# EAGLE schematic testSchema (EAGLE 7.2.0)
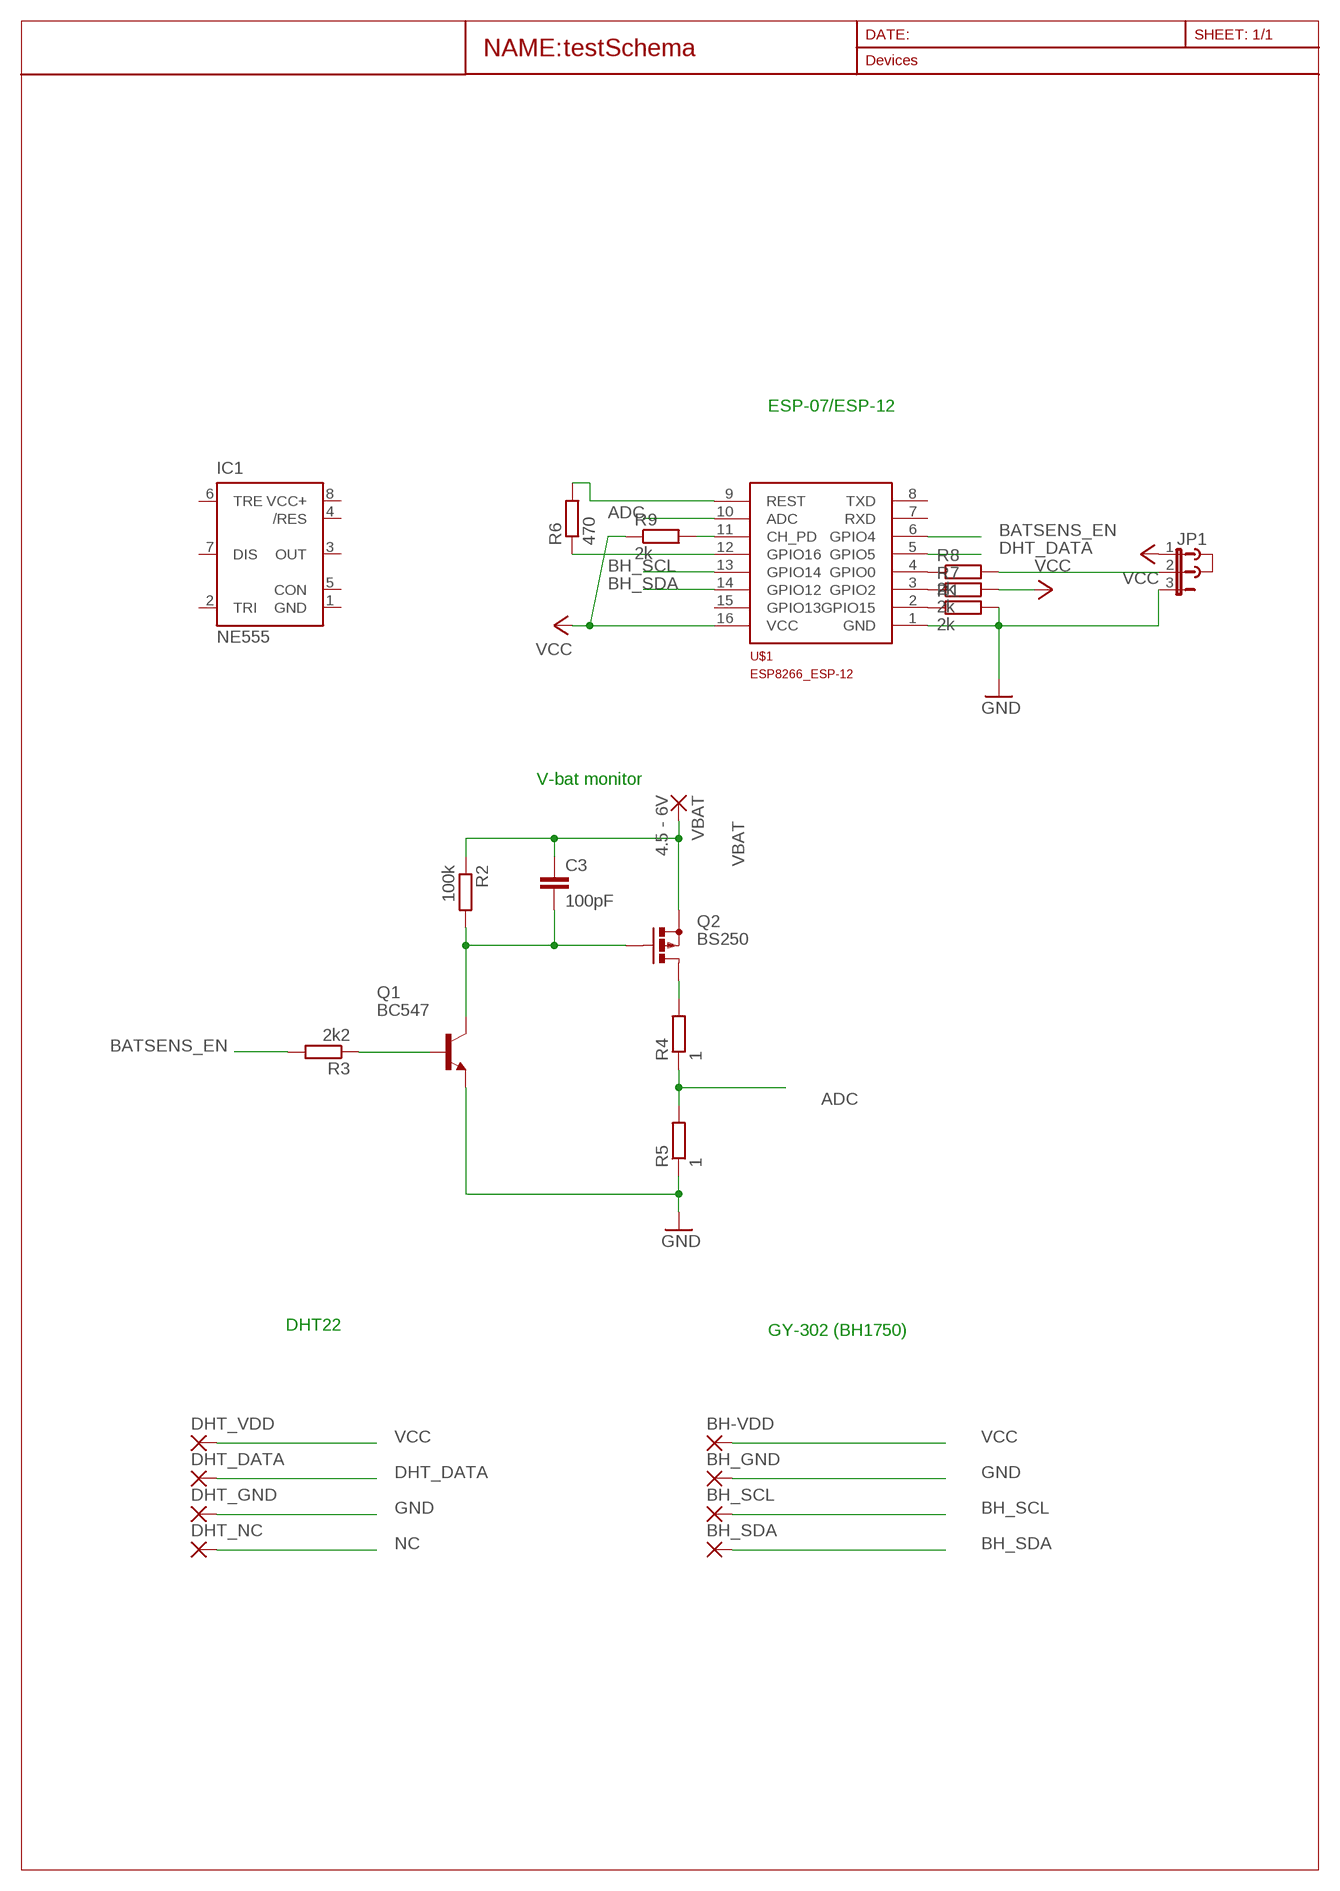
[diagram p0: schematic, sheet 1]

## Parts
BH-VDD  2,54/1,0  [2,54/1,0]
BH_GND  2,54/1,0  [2,54/1,0]
BH_SCL  2,54/1,0  [2,54/1,0]
BH_SDA  2,54/1,0  [2,54/1,0]
C3  100pF  C-EU025-025X050  [C025-025X050]
DHT_DATA  2,54/1,0  [2,54/1,0]
DHT_GND  2,54/1,0  [2,54/1,0]
DHT_NC  2,54/1,0  [2,54/1,0]
DHT_VDD  2,54/1,0  [2,54/1,0]
IC1  NE555  [DIL-08]
J1  JUMPER  [JUMP]
JP1  JP2E  [JP2]
Q1  BC547  [TO92]
Q2  BS250  [SOT54E]
R1  2k  R-EU_0204/7  [0204/7]
R2  100k  R-EU_0204/7  [0204/7]
R3  2k2  R-EU_0204/7  [0204/7]
R4  1  R-EU_0204/7  [0204/7]
R5  1  R-EU_0204/7  [0204/7]
R6  470  R-EU_0204/7  [0204/7]
R7  2k  R-EU_0204/7  [0204/7]
R8  2k  R-EU_0204/7  [0204/7]
R9  2k  R-EU_0204/7  [0204/7]
U$1  ESP8266_ESP-12  [ESP8266-ESP12]
VBAT  4.5 - 6V  2,54/1,0  [2,54/1,0]

## Nets
ADC: R4.1 R5.2 U$1.10(ADC)
BATSENS_EN: R3.2 U$1.6(GPIO4)
BH_SCL: BH_SCL.1(P) U$1.13(GPIO14)
BH_SDA: BH_SDA.1(P) U$1.14(GPIO12)
DHT_DATA: DHT_DATA.1(P) U$1.5(GPIO5)
GND: BH_GND.1(P) DHT_GND.1(P) JP1.3 Q1.1(E) R1.2 R5.1 U$1.1(GND)
N$1: R6.1 U$1.12(GPIO16)
N$2: Q2.D R4.2
N$3: R1.1 U$1.2(GPIO15)
N$4: Q1.2(B) R3.1
N$5: C3.2 Q1.3(C) Q2.G R2.2
N$6: R7.1 U$1.3(GPIO2)
N$7: JP1.2 R8.2
N$8: R8.1 U$1.4(GPIO0)
N$9: R9.2 U$1.11(CH_PD)
NC: DHT_NC.1(P)
RESET_EN: R6.2 U$1.9(REST)
VBAT: C3.1 Q2.S R2.1 VBAT.1(P)
VCC: BH-VDD.1(P) DHT_VDD.1(P) JP1.1 R7.2 R9.1 U$1.16(VCC)
Unconnected: IC1.2(TRI) IC1.3(OUT) IC1.4(/RES) IC1.5(CON) IC1.6(TRE) IC1.7(DIS) U$1.7(RXD) U$1.8(TXD) U$1.15(GPIO13)

## Notes on the sheet
- ESP-07/ESP-12
- V-bat monitor
- DHT22
- GY-302 (BH1750)

## Power pins joined to a net without a drawn wire
GND: IC1.1(GND)
VCC+: IC1.8(VCC+)

## Library data of the parts
BH-VDD BH_GND BH_SCL BH_SDA DHT_DATA DHT_GND DHT_NC DHT_VDD VBAT = wirepad:2,54/1,0: THROUGH-HOLE PAD
C3 = resistor:C-EU: CAPACITOR, European symbol
IC1 = st-microelectronics:NE555: General purpose bipolar Timer; MF: Arrow Electronics; MPN: NE555N; OC_FARNELL: 1467742; OC_NEWARK: 89K1486
J1 = jumper:JUMPER: JUMPER header
JP1 = jumper:JP2E: JUMPER
Q1 = transistor-npn:BC547*: NPN Transistor
Q2 = transistor-small-signal:BS250: P-CHANNEL MOS FET
R1-R9 = resistor:R-EU_: RESISTOR, European symbol
U$1 = ESP8266-ESP12:ESP8266_ESP-12